# Altium schematic sheet STM32.SchDoc
size A4
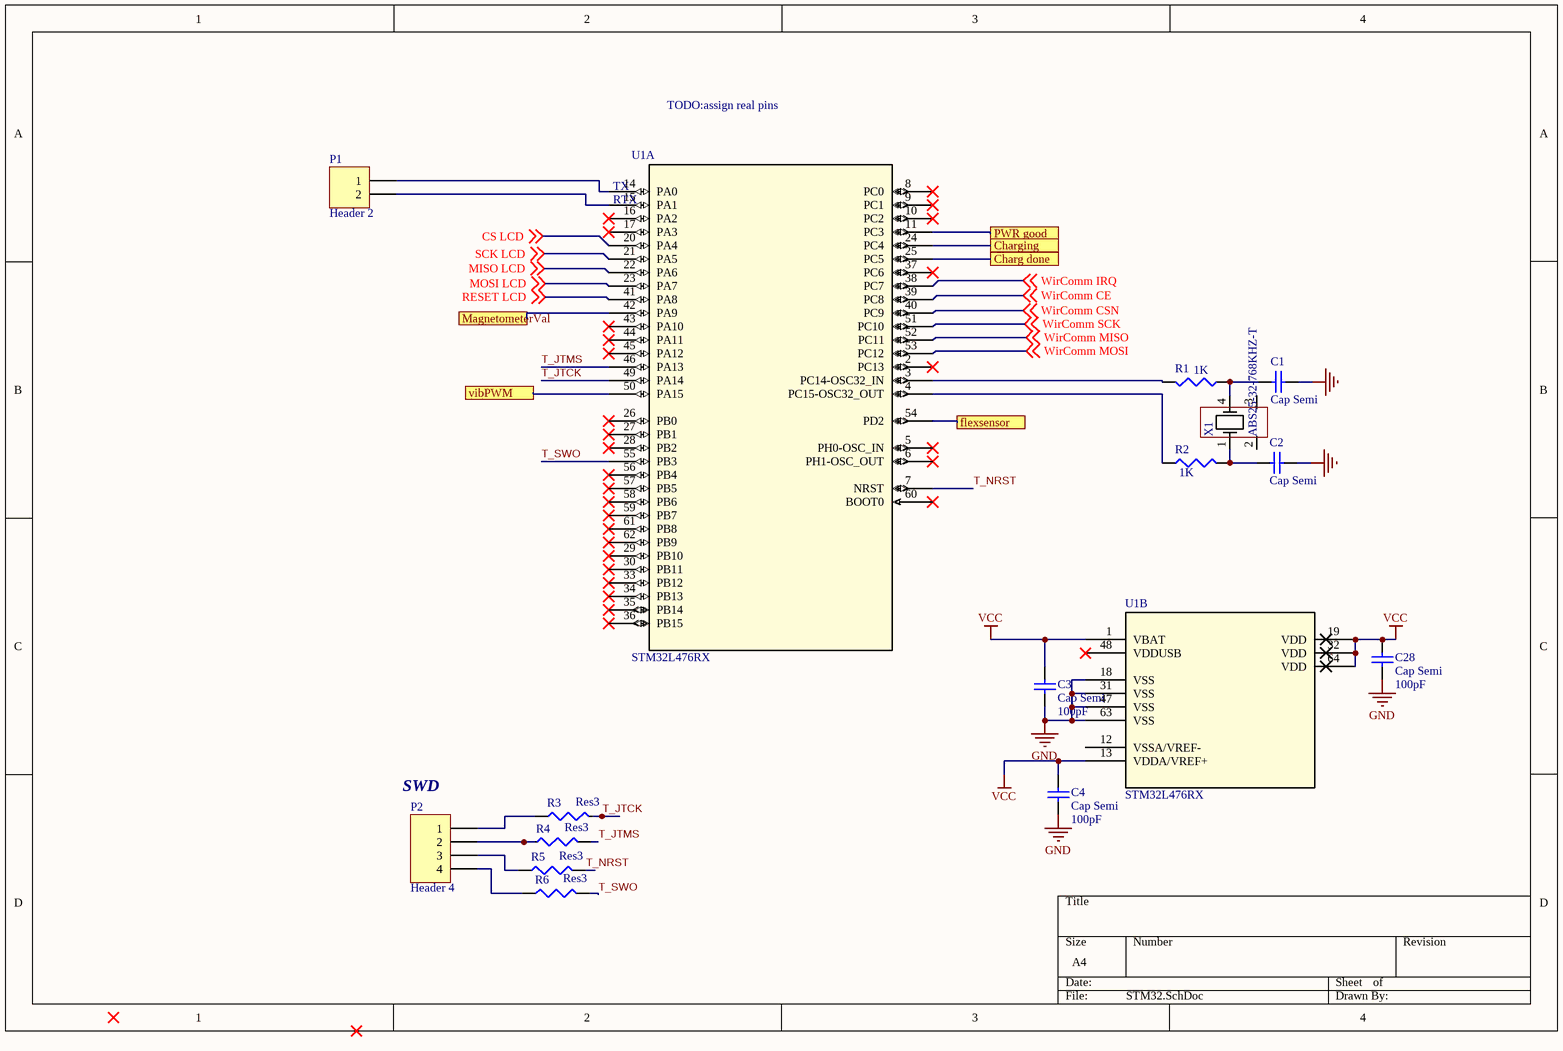
[diagram p0: STM32.SchDoc]

## Parts
C1  Cap Semi  [C1206]
C2  Cap Semi  [C1206]
C3  Cap Semi  value 100pF  [C1206]
C4  Cap Semi  value 100pF  [C1206]
C28  Cap Semi  value 100pF  [C1206]
P1  Header 2  [HDR1X2]
P2  Header 4  [HDR1X4]
R1  value 1K  [J1-0603]  (hidden comment: Res3)
R2  value 1K  [J1-0603]  (hidden comment: Res3)
R3  Res3  [J1-0603]
R4  Res3  [J1-0603]
R5  Res3  [J1-0603]
R6  Res3  [J1-0603]
U1  STM32L476RX  [LQFP64-10x10mm]  (parts A,B of 2)
X1  ABS25-32-768KHZ-T  [XTAL_ABS25-32-768KHZ-T]

## Ports
Charg done, Charging, flexsensor, MagnetometerVal, PWR good, vibPWM

## Nets
GND: C1.1 C2.1 C3.1 C4.1 C28.1 U1.18(VSS) U1.31(VSS) U1.47(VSS) U1.63(VSS)
VCC: C3.2 C4.2 C28.2 U1.1(VBAT) U1.13(VDDA/VREF+) U1.19(VDD) U1.32(VDD) U1.64(VDD)
Charg done: U1.25(PC5) ; port Charg done
Charging: U1.24(PC4) ; port Charging
CS LCD: U1.20(PA4) ; off-sheet CS LCD
flexsensor: U1.54(PD2) ; port flexsensor
MagnetometerVal: U1.42(PA9) ; port MagnetometerVal
MISO LCD: U1.22(PA6) ; off-sheet MISO LCD
MOSI LCD: U1.23(PA7) ; off-sheet MOSI LCD
PWR good: U1.11(PC3) ; port PWR good
RESET LCD: U1.41(PA8) ; off-sheet RESET LCD
SCK LCD: U1.21(PA5) ; off-sheet SCK LCD
T_JTCK: R3.2 U1.49(PA14)
T_JTMS: R4.2 U1.46(PA13)
T_NRST: R5.2 U1.7(NRST)
T_SWO: R6.2 U1.55(PB3)
vibPWM: U1.50(PA15) ; port vibPWM
WirComm CE: U1.39(PC8) ; off-sheet WirComm CE
WirComm CSN: U1.40(PC9) ; off-sheet WirComm CSN
WirComm IRQ: U1.38(PC7) ; off-sheet WirComm IRQ
WirComm MISO: U1.52(PC11) ; off-sheet WirComm MISO
WirComm MOSI: U1.53(PC12) ; off-sheet WirComm MOSI
WirComm SCK: U1.51(PC10) ; off-sheet WirComm SCK
NetC1_2: C1.2 R1.2 X1.4
NetC2_2: C2.2 R2.2 X1.1
NetP1_1: P1.1 U1.14(PA0)
NetP1_2: P1.2 U1.15(PA1)
NetP2_1: P2.1 R3.1
NetP2_2: P2.2 R4.1
NetP2_3: P2.3 R5.1
NetP2_4: P2.4 R6.1
NetR1_1: R1.1 U1.3(PC14-OSC32_IN)
NetR2_1: R2.1 U1.4(PC15-OSC32_OUT)

Not connected (* = marked no-connect by the designer): U1 2(PC13)* 5(PH0-OSC_IN)* 6(PH1-OSC_OUT)* 8(PC0)* 9(PC1)* 10(PC2)* 12(VSSA/VREF-) 16(PA2)* 17(PA3)* 26(PB0)* 27(PB1)* 28(PB2)* 29(PB10)* 30(PB11)* 33(PB12)* 34(PB13)* 35(PB14)* 36(PB15)* 37(PC6)* 43(PA10)* 44(PA11)* 45(PA12)* 48(VDDUSB)* 56(PB4)* 57(PB5)* 58(PB6)* 59(PB7)* 60(BOOT0)* 61(PB8)* 62(PB9)*; X1 2 3

## Notes on the sheet
- TODO:assign real pins
- (near U1) TX
- (near U1) RTX
- (near P2) SWD

## Library data of the parts
C1 C2 = Cap Semi: Capacitor (Semiconductor SIM Model); Value: 100pF; Published: 8-Jun-2000; LatestRevisionDate: 29-May-2009; LatestRevisionNote: IPC-7351 Footprint Added.; PackageReference: C1206; Publisher: Altium Limited; PackageDescription: Chip Capacitor
C3 C4 C28 = Cap Semi: Capacitor (Semiconductor SIM Model); Published: 8-Jun-2000; LatestRevisionDate: 29-May-2009; LatestRevisionNote: IPC-7351 Footprint Added.; PackageReference: C1206; Publisher: Altium Limited; PackageDescription: Chip Capacitor
P1 = Header 2: Header, 2-Pin; LatestRevisionDate: 17-Jul-2002; LatestRevisionNote: Re-released for DXP Platform.; Publisher: Altium Limited
P2 = Header 4: Header, 4-Pin; LatestRevisionDate: 17-Jul-2002; LatestRevisionNote: Re-released for DXP Platform.; Publisher: Altium Limited
R1 R2 = Res3: Resistor; Published: 8-Jun-2000; Publisher: Altium Limited; LatestRevisionDate: 29-May-2009; LatestRevisionNote: IPC-7351 Footprint Added.; PackageReference: J1-0603; PackageDescription: Chip Resistor
R3-R6 = Res3: Resistor; Value: 1K; Published: 8-Jun-2000; LatestRevisionDate: 29-May-2009; LatestRevisionNote: IPC-7351 Footprint Added.; PackageReference: J1-0603; Publisher: Altium Limited; PackageDescription: Chip Resistor
U1 = STM32L476RX: Imported; Vendor: ST Microelectronics; Copyright: Copyright (C) 2016 Accelerated Designs. All rights reserved; Manufacturer_Part_Number: stm32l476rx; Value: Value; Type: Type; RefDes: RefDes
X1 = ABS25-32-768KHZ-T: MF: Abracon; SnapEDA_Link: https://www.snapeda.com/symbols-footprints/ABS25-32-768KHZ-T/Abracon/view-part/?ref=snap; MP: ABS25-32-768KHZ-T; Availability: Unavailable; Price: None; Package: None; Value: *